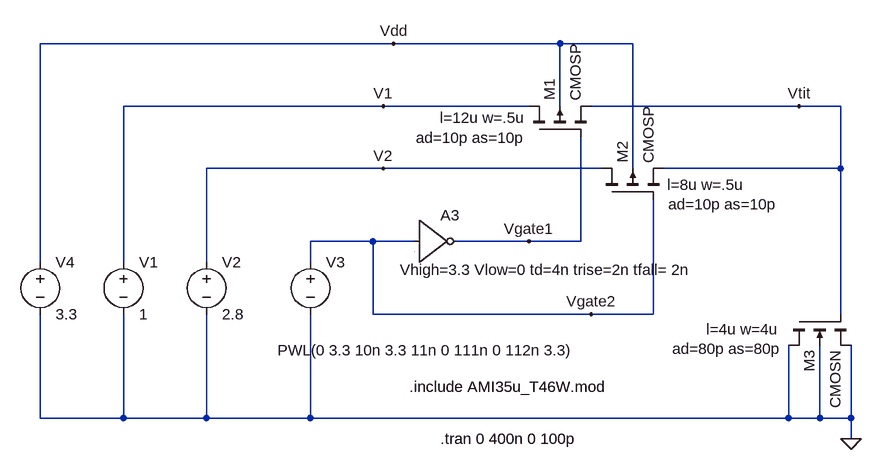
[diagram p0: schematic ChgInj.asc]
ChgInj.asc, the LTspice schematic file:
Version 4
SHEET 1 880 680
WIRE -352 -48 -896 -48
WIRE -96 -48 -352 -48
WIRE 16 -48 -96 -48
WIRE -368 48 -768 48
WIRE -144 48 -368 48
WIRE -96 48 -96 -48
WIRE 272 48 -48 48
WIRE 336 48 272 48
WIRE -368 144 -640 144
WIRE -32 144 -368 144
WIRE 16 144 16 -48
WIRE 336 144 336 48
WIRE 336 144 64 144
WIRE -384 256 -480 256
WIRE -320 256 -384 256
WIRE -144 256 -256 256
WIRE -64 256 -64 96
WIRE -64 256 -144 256
WIRE -896 288 -896 -48
WIRE -768 288 -768 48
WIRE -640 288 -640 144
WIRE -480 288 -480 256
WIRE -384 368 -384 256
WIRE -48 368 -384 368
WIRE 48 368 48 192
WIRE 48 368 -48 368
WIRE 336 368 336 144
WIRE -896 528 -896 368
WIRE -768 528 -768 368
WIRE -768 528 -896 528
WIRE -640 528 -640 368
WIRE -640 528 -768 528
WIRE -480 528 -480 368
WIRE -480 528 -640 528
WIRE 256 528 256 416
WIRE 256 528 -480 528
WIRE 304 528 304 416
WIRE 304 528 256 528
WIRE 352 528 352 416
WIRE 352 528 304 528
WIRE 352 560 352 528
FLAG 352 560 0
FLAG -352 -48 Vdd
FLAG -368 48 V1
FLAG -368 144 V2
FLAG 272 48 Vtit
FLAG -144 256 Vgate1
FLAG -48 368 Vgate2
SYMBOL pmos4 -144 96 R270
WINDOW 123 30 -5 VLeft 0
WINDOW 39 -1 -5 VLeft 0
SYMATTR InstName M1
SYMATTR Value2 l=12u w=.5u
SYMATTR Value CMOSP
SYMATTR SpiceLine ad=10p as=10p
SYMBOL pmos4 -32 192 R270
WINDOW 123 23 101 VRight 0
WINDOW 39 -7 103 VRight 0
SYMATTR InstName M2
SYMATTR Value2 l=8u w=.5u
SYMATTR Value CMOSP
SYMATTR SpiceLine ad=10p as=10p
SYMBOL Digital\\inv -320 192 R0
WINDOW 3 -22 108 Left 0
SYMATTR Value Vhigh=3.3 Vlow=0 td=4n trise=2n tfall= 2n
SYMATTR InstName A3
SYMBOL voltage -768 272 R0
SYMATTR InstName V1
SYMATTR Value 1
SYMBOL voltage -640 272 R0
SYMATTR InstName V2
SYMATTR Value 2.8
SYMBOL voltage -480 272 R0
WINDOW 3 -51 152 Left 0
WINDOW 123 0 0 Left 0
WINDOW 39 0 0 Left 0
SYMATTR Value PWL(0 3.3 10n 3.3 11n 0 111n 0 112n 3.3)
SYMATTR InstName V3
SYMBOL voltage -896 272 R0
SYMATTR InstName V4
SYMATTR Value 3.3
SYMBOL nmos4 256 368 M90
WINDOW 123 23 -15 VLeft 0
WINDOW 39 53 -10 VLeft 0
SYMATTR InstName M3
SYMATTR Value CMOSN
SYMATTR Value2 l=4u w=4u
SYMATTR SpiceLine ad=80p as=80p
TEXT -280 560 Left 0 !.tran 0 400n 0 100p
TEXT -328 480 Left 0 !.include AMI35u_T46W.mod

The netlist it stands for:
* ChgInj.asc
M1 V1 Vgate1 Vtit Vdd CMOSP l=12u w=.5u ad=10p as=10p
M2 V2 Vgate2 Vtit Vdd CMOSP l=8u w=.5u ad=10p as=10p
A3 Vgate2 0 0 0 0 Vgate1 0 0 BUF Vhigh=3.3 Vlow=0 td=4n trise=2n tfall= 2n
V1 V1 0 1
V2 V2 0 2.8
V3 Vgate2 0 PWL(0 3.3 10n 3.3 11n 0 111n 0 112n 3.3)
V4 Vdd 0 3.3
M3 0 Vtit 0 0 CMOSN l=4u w=4u ad=80p as=80p
.model NMOS NMOS
.model PMOS PMOS
.lib standard.mos
.tran 0 400n 0 100p
.include AMI35u_T46W.mod
.backanno
.end